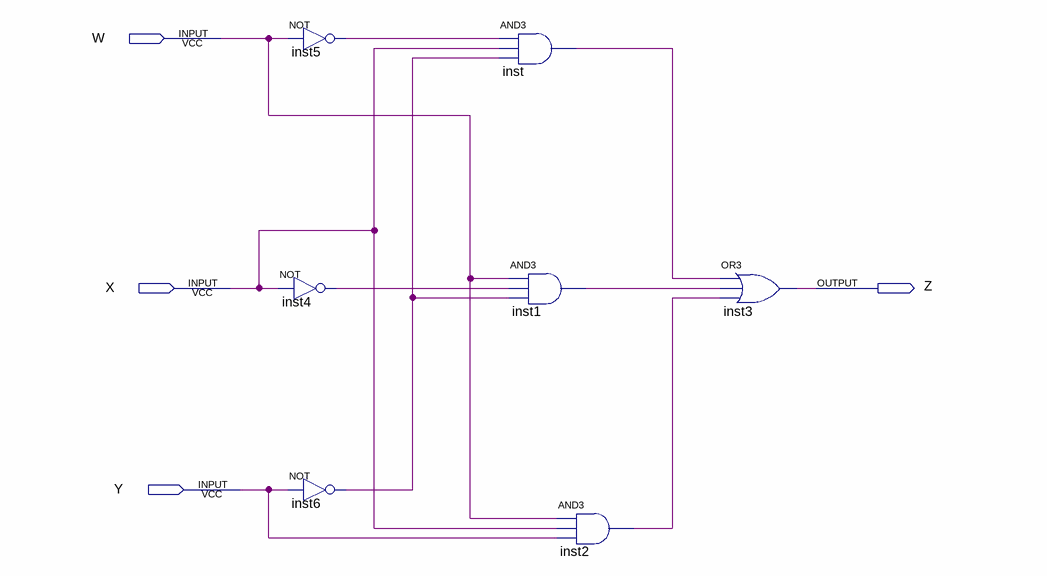
[diagram p0: schematic sheet]
// Quartus schematic lab1step2.bdf as structural Verilog: 7 symbols, 4 pins
module lab1step2 (
  input  W,
  input  X,
  input  Y,
  output Z
);

  wire inst1_out, inst2_out, inst4_out, inst5_out, inst6_out, inst_out;

  not inst5 (inst5_out, W);
  not inst4 (inst4_out, X);
  not inst6 (inst6_out, Y);
  and inst (inst_out, inst5_out, X, inst6_out);
  and inst1 (inst1_out, W, inst4_out, inst6_out);
  and inst2 (inst2_out, W, X, Y);
  or inst3 (Z, inst_out, inst1_out, inst2_out);
endmodule
